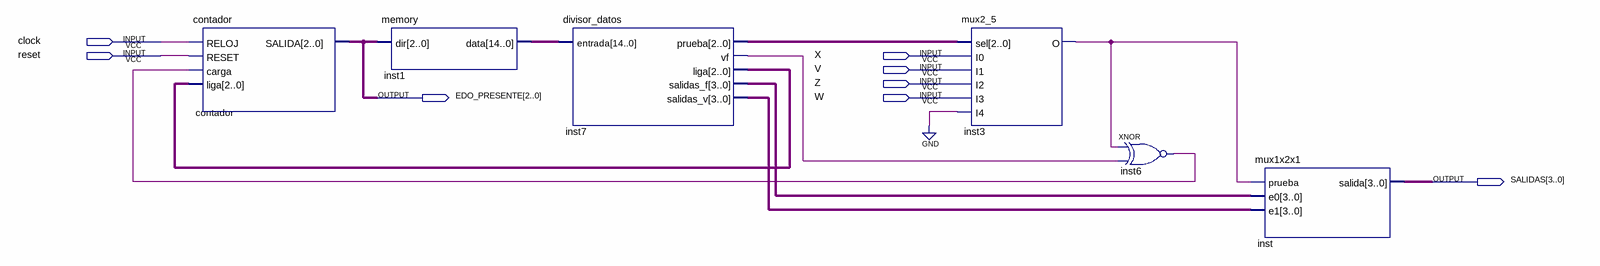
[diagram p0: schematic sheet]
// Quartus schematic practica05.bdf as structural Verilog: 6 symbols, 8 pins
module practica05 (
  input  clock,
  input  reset,
  input  X,
  input  V,
  input  Z,
  input  W,
  output [2:0] EDO_PRESENTE,
  output [3:0] SALIDAS
);

  wire inst3_o, inst6_out, inst7_vf;
  wire [2:0] inst7_liga, inst7_prueba;
  wire [3:0] inst7_salidas_f, inst7_salidas_v;
  wire [14:0] inst1_data;

  contador contador (.RELOJ(clock), .RESET(reset), .carga(inst6_out), .liga(inst7_liga), .SALIDA(EDO_PRESENTE));
  memory inst1 (.dir(EDO_PRESENTE), .data(inst1_data));
  divisor_datos inst7 (
    .entrada(inst1_data), .prueba(inst7_prueba), .vf(inst7_vf), .liga(inst7_liga),
    .salidas_f(inst7_salidas_f), .salidas_v(inst7_salidas_v));
  mux2_5 inst3 (.sel(inst7_prueba), .I0(X), .I1(V), .I2(Z), .I3(W), .I4(1'b0), .O(inst3_o));
  xnor inst6 (inst6_out, inst3_o, inst7_vf);
  mux1x2x1 inst (.prueba(inst3_o), .e0(inst7_salidas_f), .e1(inst7_salidas_v), .salida(SALIDAS));
endmodule
